# EAGLE design ex_v2 (EAGLE 9.7.0)
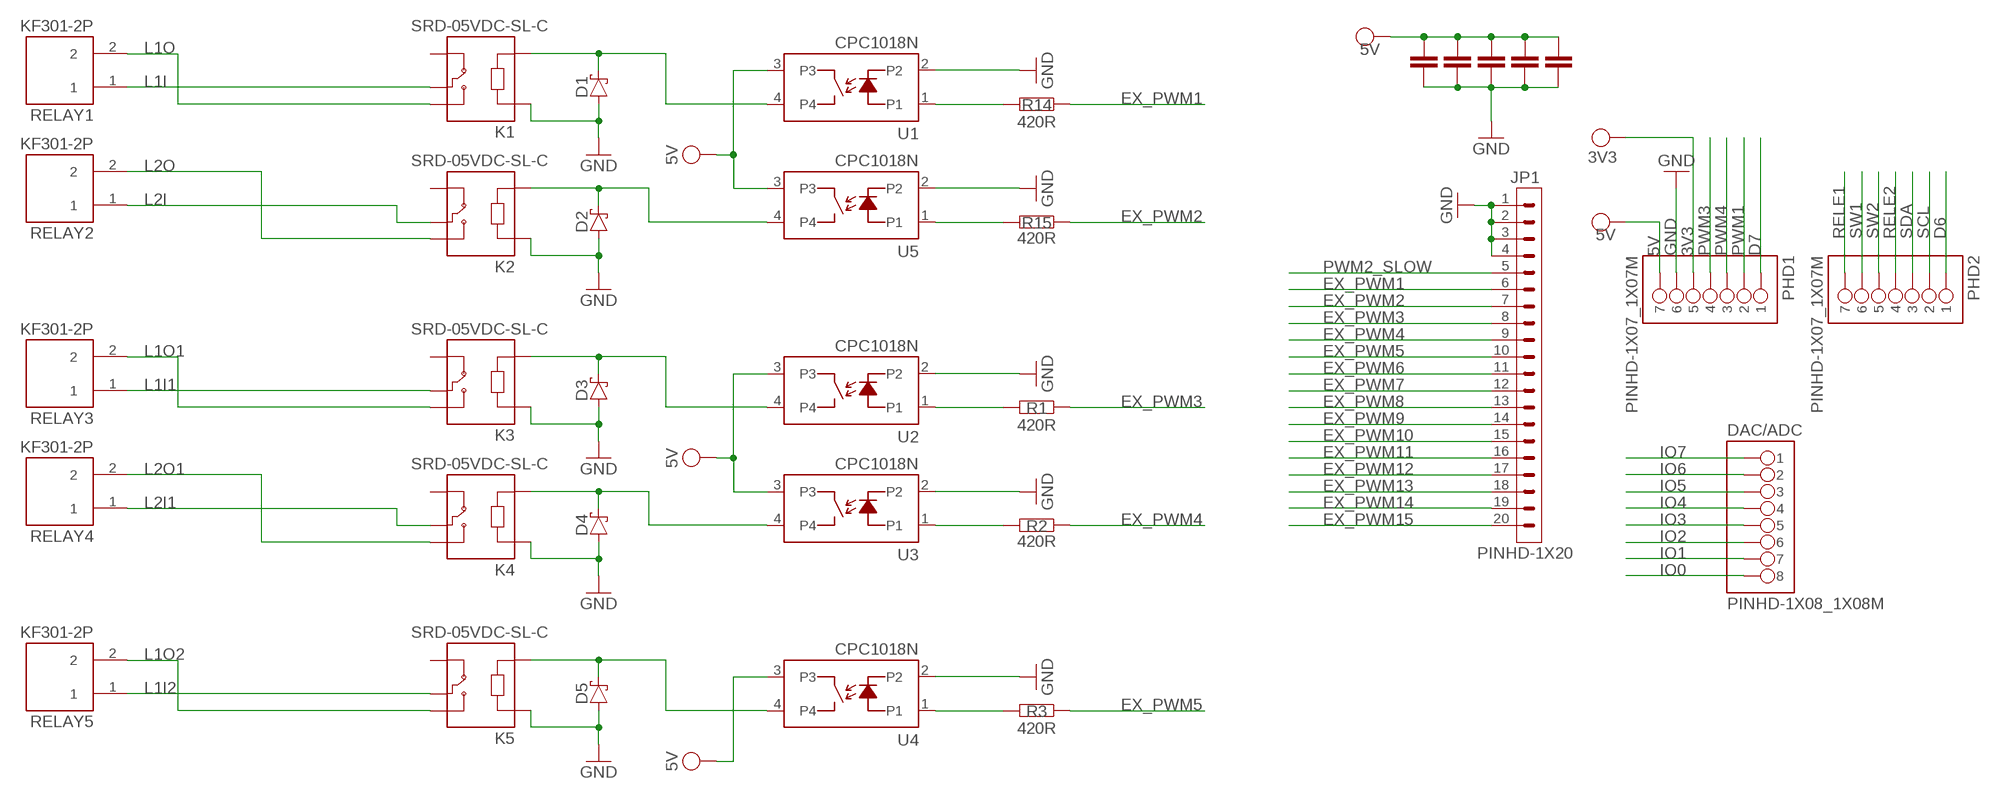
[diagram p0: schematic, sheet 1]

## Parts
C1  10uF  C_CHIP-0805(2012-METRIC)  [CAPC2012X110]
C2  10uF  C_CHIP-0805(2012-METRIC)  [CAPC2012X110]
C3  10uF  C_CHIP-0805(2012-METRIC)  [CAPC2012X110]
C6  10uF  C_CHIP-0805(2012-METRIC)  [CAPC2012X110]
C8  10uF  C_CHIP-0805(2012-METRIC)  [CAPC2012X110]
D1  SCHOTTKY_MBR0520LT1GDO-219  [SODFL3718X115]
D2  SCHOTTKY_MBR0520LT1GDO-219  [SODFL3718X115]
D3  SCHOTTKY_MBR0520LT1GDO-219  [SODFL3718X115]
D4  SCHOTTKY_MBR0520LT1GDO-219  [SODFL3718X115]
D5  SCHOTTKY_MBR0520LT1GDO-219  [SODFL3718X115]
DAC/ADC  PINHD-1X08_1X08M  [1X08]
JP1  PINHD-1X20  [1X20]
K1  SRD-05VDC-SL-C  [RELAY_SRD-05VDC-SL-C]
K2  SRD-05VDC-SL-C  [RELAY_SRD-05VDC-SL-C]
K3  SRD-05VDC-SL-C  [RELAY_SRD-05VDC-SL-C]
K4  SRD-05VDC-SL-C  [RELAY_SRD-05VDC-SL-C]
K5  SRD-05VDC-SL-C  [RELAY_SRD-05VDC-SL-C]
PHD1  PINHD-1X07_1X07M  [1X07]
PHD2  PINHD-1X07_1X07M  [1X07]
R1  420R  R_CHIP-0603(1608-METRIC)  [RESC1608X60]
R2  420R  R_CHIP-0603(1608-METRIC)  [RESC1608X60]
R3  420R  R_CHIP-0603(1608-METRIC)  [RESC1608X60]
R14  420R  R_CHIP-0603(1608-METRIC)  [RESC1608X60]
R15  420R  R_CHIP-0603(1608-METRIC)  [RESC1608X60]
RELAY1  KF301-2P  [HANDSON_KF301-2P]
RELAY2  KF301-2P  [HANDSON_KF301-2P]
RELAY3  KF301-2P  [HANDSON_KF301-2P]
RELAY4  KF301-2P  [HANDSON_KF301-2P]
RELAY5  KF301-2P  [HANDSON_KF301-2P]
U1  CPC1018N  [CLARE_SO4]
U2  CPC1018N  [CLARE_SO4]
U3  CPC1018N  [CLARE_SO4]
U4  CPC1018N  [CLARE_SO4]
U5  CPC1018N  [CLARE_SO4]

## Nets
3V3: PHD1.5
5V: C1.1 C2.1 C3.1 C6.1 C8.1 PHD1.7 U1.3 U2.3 U3.3 U4.3 U5.3
D6: PHD2.1
D7: PHD1.1
EX_PWM1: JP1.6 R14.1
EX_PWM2: JP1.7 R15.1
EX_PWM3: JP1.8 R1.1
EX_PWM4: JP1.9 R2.1
EX_PWM5: JP1.10 R3.1
EX_PWM6: JP1.11
EX_PWM7: JP1.12
EX_PWM8: JP1.13
EX_PWM9: JP1.14
EX_PWM10: JP1.15
EX_PWM11: JP1.16
EX_PWM12: JP1.17
EX_PWM13: JP1.18
EX_PWM14: JP1.19
EX_PWM15: JP1.20
GND: C1.2 C2.2 C3.2 C6.2 C8.2 D1.2(A) D2.2(A) D3.2(A) D4.2(A) D5.2(A) JP1.1 JP1.2 JP1.3 JP1.4 K1.A1 K2.A1 K3.A1 K4.A1 K5.A1 PHD1.6 U1.2 U2.2 U3.2 U4.2 U5.2
IO0: DAC/ADC.8
IO1: DAC/ADC.7
IO2: DAC/ADC.6
IO3: DAC/ADC.5
IO4: DAC/ADC.4
IO5: DAC/ADC.3
IO6: DAC/ADC.2
IO7: DAC/ADC.1
L1I: K1.COM RELAY1.1
L1I1: K3.COM RELAY3.1
L1I2: K5.COM RELAY5.1
L1O: K1.NO RELAY1.2
L1O1: K3.NO RELAY3.2
L1O2: K5.NO RELAY5.2
L2I: K2.COM RELAY2.1
L2I1: K4.COM RELAY4.1
L2O: K2.NO RELAY2.2
L2O1: K4.NO RELAY4.2
N$3: R1.2 U2.1
N$4: R2.2 U3.1
N$5: D4.1(C) K4.A2 U3.4
N$6: D3.1(C) K3.A2 U2.4
N$8: D2.1(C) K2.A2 U5.4
N$9: D1.1(C) K1.A2 U1.4
N$11: R3.2 U4.1
N$14: D5.1(C) K5.A2 U4.4
N$18: R14.2 U1.1
N$19: R15.2 U5.1
PWM1: PHD1.2
PWM2_SLOW: JP1.5
PWM3: PHD1.4
PWM4: PHD1.3
RELE1: PHD2.7
RELE2: PHD2.4
SCL: PHD2.2
SDA: PHD2.3
SW1: PHD2.6
SW2: PHD2.5
Unconnected: K1.NC K2.NC K3.NC K4.NC K5.NC

## Library data of the parts
C1-C3 C6 C8 = Capacitor:C: Capacitor - Generic; CATEGORY: Capacitor; PACKAGE_SIZE: 0805; PACKAGE_TYPE: SMD; SUBCATEGORY: Ceramic Capacitors; TYPE: MLCC
D1-D5 = Diode:SCHOTTKY_: Schottky Diode - Popular Parts; CATEGORY: Diode; DATASHEET: https://www.onsemi.com/download/data-sheet/pdf/mbr0520lt1-d.pdf; DESCRIPTION: Diode 20 V 500mA Surface Mount SOD-123; FORWARD_CURRENT: 500mA; FORWARD_VOLTAGE: 385mV; MANUFACTURER: onsemi; MPN: MBR0520LT1G; OPERATING_TEMPERATURE: -65°C ~ 125°C; PACKAGE_SIZE: SOD-123; PACKAGE_TYPE: Surface Mount; PART_STATUS: Active; REVERSE_VOLTAGE: 20V; ROHS: Compliant; SERIES: MBR0520; SUBCATEGORY: Schottky Diodes; TYPE: Schottky Power Rectifier; ZENER_VOLTAGE: NA
DAC/ADC = Tinkercad:PINHD-1X08
JP1 = Connector:PINHD-1X20: Pin Header; CATEGORY: Connectors; DESCRIPTION: Header-Straight-10 Position; PACKAGE_TYPE: Through Hole; PITCH: 0.100" (2.54mm); SUBCATEGORY: Headers; TYPE: Male Pins
K1-K5 = SRD-05VDC-SL-C:SRD-05VDC-SL-C: Check availability <https://pricing.snapeda.com/parts/SRD-05VDC-SL-C/Songle%20Relay/view-part?ref=eda>; AVAILABILITY: In Stock; CHECK_PRICES: https://www.snapeda.com/parts/SRD-05VDC-SL-C/Songle+Relay/view-part/?ref=eda; DESCRIPTION: 5V Trigger Relay Module For Arduino And Raspberry Pi 5V Trigger Relay Module For Arduino And Raspberry Pi; MF: Songle Relay; MP: SRD-05VDC-SL-C; PACKAGE: NON STANDARD-5 Songle Relay; PRICE: None; SNAPEDA_LINK: https://www.snapeda.com/parts/SRD-05VDC-SL-C/Songle+Relay/view-part/?ref=snap
PHD1 PHD2 = Tinkercad:PINHD-1X07
R1-R3 R14 R15 = Resistor:R: Resistor Fixed - Generic; CATEGORY: Resistors; DESCRIPTION: Chip Resistor 1.60 X 0.82 X 0.60 mm body 0603(1608-METRIC) Package; PACKAGE_SIZE: 0603; PACKAGE_TYPE: SMD
RELAY1-RELAY5 = KF301-2P:KF301-2P: Check availability <https://pricing.snapeda.com/parts/KF301-2P/Handson%20Technology/view-part?ref=eda>; AVAILABILITY: Not in stock; CHECK_PRICES: https://www.snapeda.com/parts/KF301-2P/Handson+Technology/view-part/?ref=eda; DESCRIPTION: 2 Pin Terminal Block 5mm Pitch; MF: Handson Technology; MP: KF301-2P; PACKAGE: None; PRICE: None; SNAPEDA_LINK: https://www.snapeda.com/parts/KF301-2P/Handson+Technology/view-part/?ref=snap
U1-U5 = CPC1018N:CPC1018N: Check availability <https://pricing.snapeda.com/parts/CPC1018N/IXYS%20Integrated%20Circuits/view-part?ref=eda>; AVAILABILITY: In Stock; CHECK_PRICES: https://www.snapeda.com/parts/CPC1018N/IXYS/view-part/?ref=eda; DESCRIPTION: Solid State Photo-Coupled Relay (Photorelay) SPST-NO (1 Form A) 4-SOP (0.150, 3.81mm); MF: IXYS Integrated Circuits; MP: CPC1018N; PACKAGE: SOP-4 Ixys Corporation; PRICE: None; SNAPEDA_LINK: https://www.snapeda.com/parts/CPC1018N/IXYS/view-part/?ref=snap

## Board
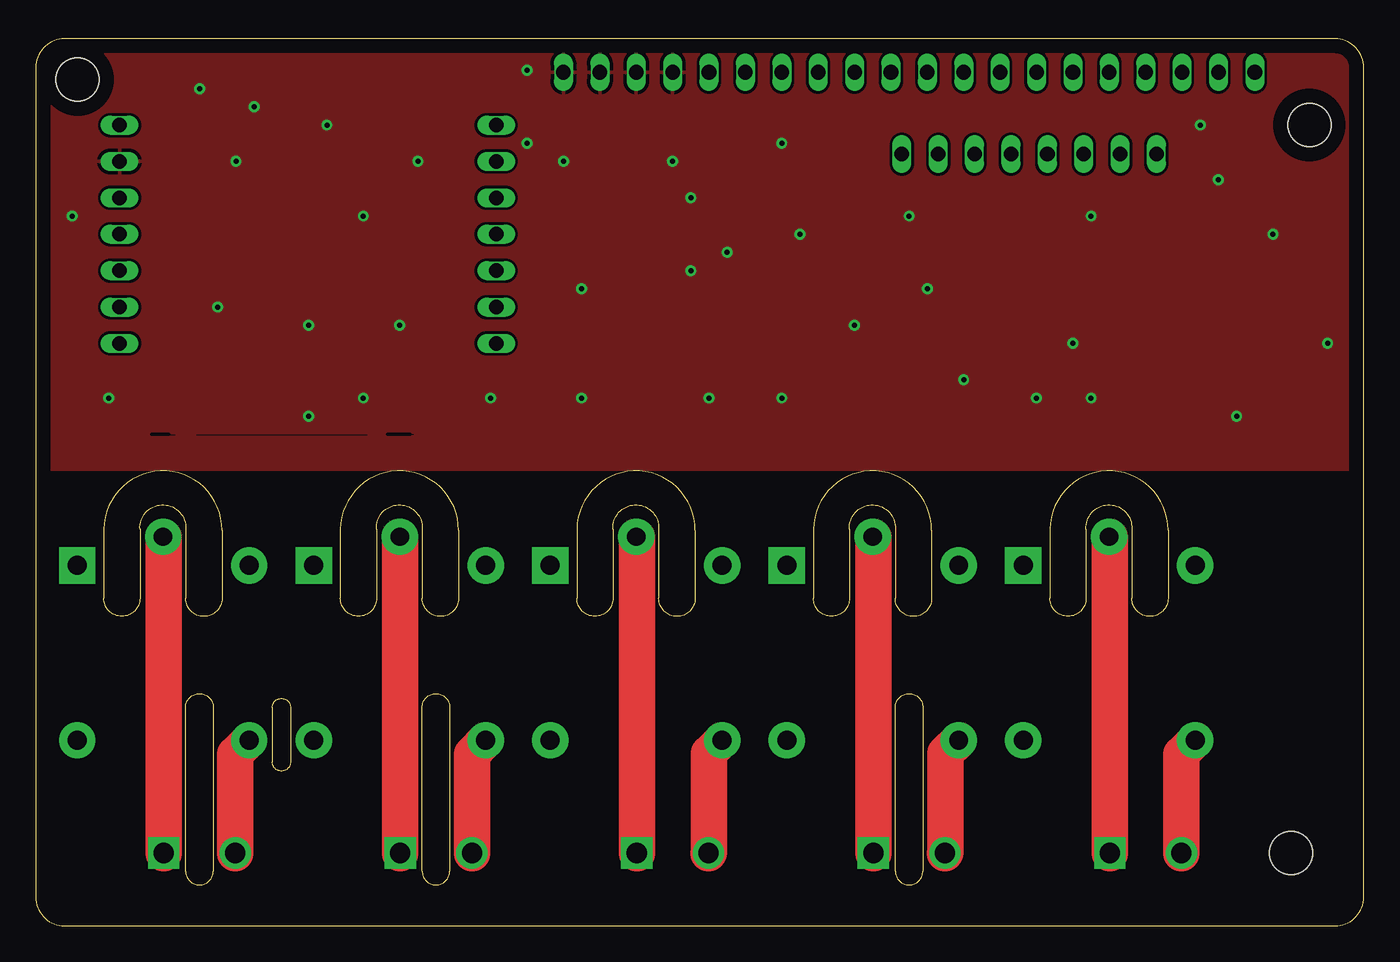
[diagram p1: board, top side]
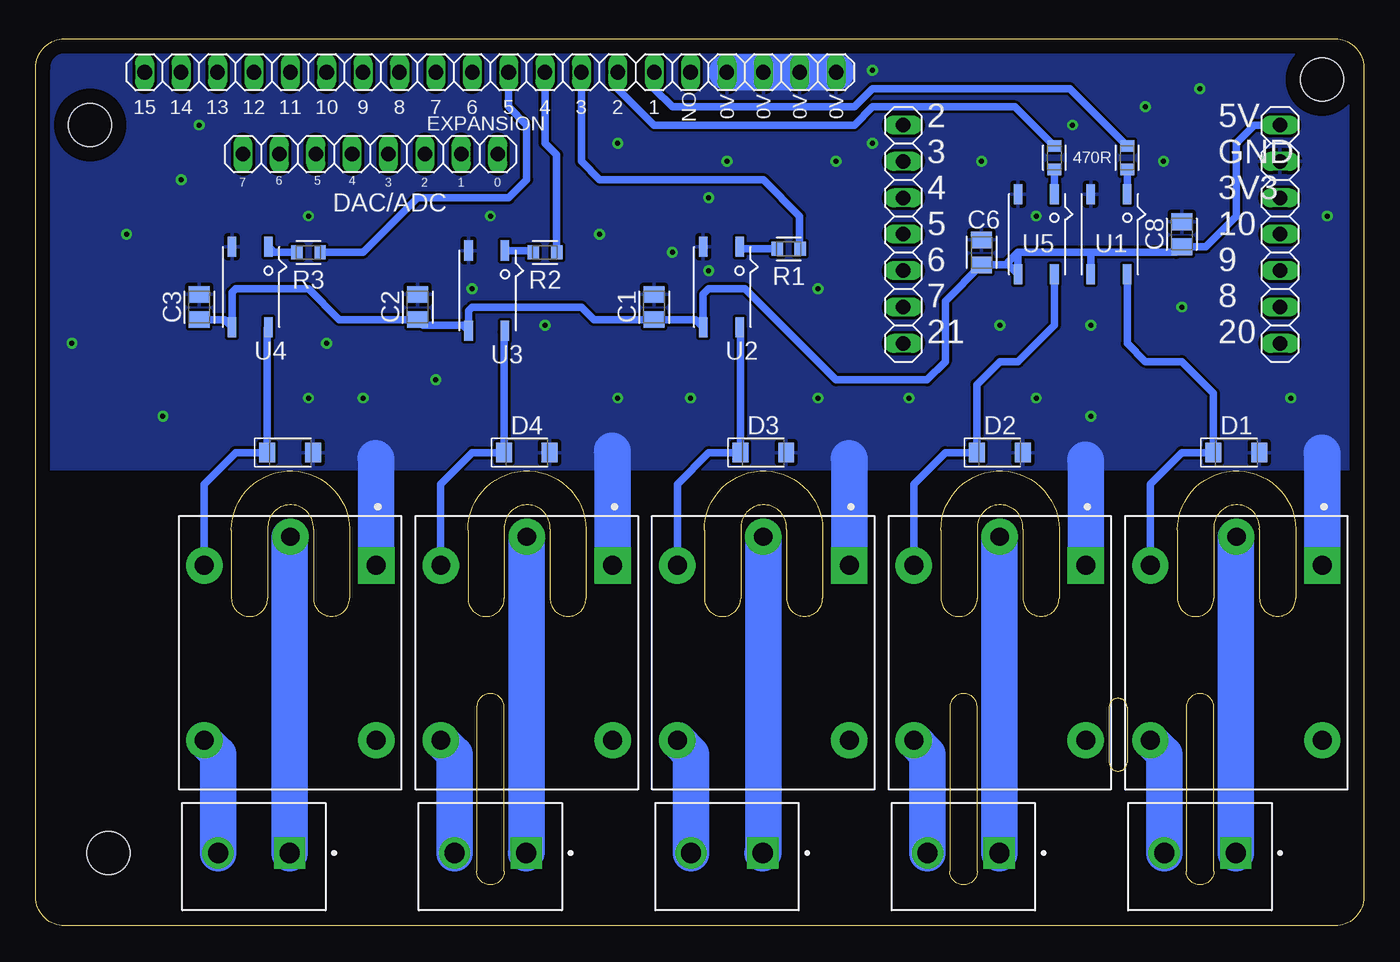
[diagram p2: board, bottom side, seen from below]

Size 92.69 x 61.9 mm. Coordinates in mm from the lower left corner, seen from the top.
Outline: 0,59.9 0,2 arc90 2,0 90.69,0 arc90 92.69,2 92.69,59.9 arc90 90.69,61.9 2,61.9 arc90 0,59.9
Copper layers (1*16): Top 0.035mm / dielectric 1.5mm / Bottom 0.035mm
Design rules "Fusion Electronics Design Rules *": minimum track width 0.2mm, minimum drill 0.35mm, track to track 0.2mm, track to pad 0.2mm, pad to pad 6mil, via to via 6mil, smd to smd 6mil, copper to edge 40mil, drill to drill 6mil, minimum pad ring 0.1mm, minimum via ring 0.204mm, stop-mask expansion 4mil, vias tented up to drill 9999mil, thermal gap 10mil
Holes 3 mm at 88.9,55.88 87.63,5.08 2.92,59.05
tRestrict: 5 lines
Milling: 56 lines

### Footprints (pad centres in the part's own frame; a part is rotated, then mirrored left to right if it is on the bottom)
CAPC2012X110 = smd 1.165 x 1.465: 1 -0.875,0; 2 0.875,0
SODFL3718X115 = smd 1.115 x 1.361: 1 -1.6,0; 2 1.6,0
1X08 = drill 1.016 long: 1 -8.89,0; 2 -6.35,0; 3 -3.81,0; 4 -1.27,0; 5 1.27,0; 6 3.81,0; 7 6.35,0; 8 8.89,0
1X20 = drill 1.016 long: 1 -24.13,0; 2 -21.59,0; 3 -19.05,0; 4 -16.51,0; 5 -13.97,0; 6 -11.43,0; 7 -8.89,0; 8 -6.35,0; 9 -3.81,0; 10 -1.27,0; 11 1.27,0; 12 3.81,0; 13 6.35,0; 14 8.89,0; 15 11.43,0; 16 13.97,0; 17 16.51,0; 18 19.05,0; 19 21.59,0; 20 24.13,0
RELAY_SRD-05VDC-SL-C = drill 1.32 pad 2.54 square: A1 -6.1,6 | drill 1.32 pad 2.54: A2 -6.1,-6; NC 6.1,6; NO 6.1,-6 | drill 1.29 pad 2.54: COM -8.1,0
1X07 = drill 1.016 long: 1 -7.62,0; 2 -5.08,0; 3 -2.54,0; 4 0,0; 5 2.54,0; 6 5.08,0; 7 7.62,0
RESC1608X60 = smd 0.799 x 0.974: 1 -0.815,0; 2 0.815,0
HANDSON_KF301-2P = drill 1.4 pad 2.184 square: 1 -2.5,0 | drill 1.4 pad 2.184: 2 2.5,0
CLARE_SO4 = smd 0.6 x 1.4: 1 -1.27,-2.8; 2 1.27,-2.8; 3 1.27,2.8; 4 -1.27,2.8

### Placement (x,y rotation side)
C1  49.53,43.18 90 bottom
C2  66.04,43.18 90 bottom
C3  81.28,43.18 90 bottom
C6  26.67,46.99 90 bottom
C8  12.7,48.26 90 bottom
D1  8.89,33.02 0 bottom
D2  25.4,33.02 0 bottom
D3  41.91,33.02 0 bottom
D4  58.42,33.02 0 bottom
D5  74.93,33.02 0 bottom
DAC/ADC  69.34,53.85 0 bottom
JP1  60.96,59.56 180 bottom
K1  8.89,19.05 270 bottom
K2  25.4,19.05 270 bottom
K3  41.91,19.05 270 bottom
K4  58.42,19.05 270 bottom
K5  74.93,19.05 270 bottom
PHD1  5.84,48.26 90 bottom
PHD2  32.13,48.26 90 bottom
R1  40.13,47.24 180 bottom
R2  57.15,46.99 180 bottom
R3  73.66,46.99 180 bottom
R14  16.51,53.59 270 bottom
R15  21.59,53.59 270 bottom
RELAY1  11.43,5.08 180 bottom
RELAY2  27.94,5.08 180 bottom
RELAY3  44.45,5.08 180 bottom
RELAY4  60.96,5.08 180 bottom
RELAY5  77.47,5.08 180 bottom
U1  17.78,48.26 180 bottom
U2  44.83,44.58 180 bottom
U3  61.21,44.32 180 bottom
U4  77.72,44.58 180 bottom
U5  22.86,48.26 180 bottom

### Tracks (layer width: path | path; a pad name or v marks a point on that pad's centre or on a via)
5V
  Bottom 0.508: C3.1 79.52,42.3 U4.3 78.99,44.2 78.74,44.45 73.66,44.45 71.52,42.3 C2.1 65.64,41.91 62.87,41.91 U3.3 62.48,42.93 62.23,43.18 54.61,43.18 53.73,42.3 C1.1 46.63,42.3 U2.3 46.1,44.07 45.72,44.45 43.18,44.45 36.83,38.1 30.48,38.1 29.21,39.37 29.21,43.58 C6.1 24.79,46.12 | U1.3 19.05,46.99 | 19.05,46.99 24.13,46.99 | 24.13,46.99 U5.3 24.79,46.12 | 24.79,46.12 24.79,46.34 24.13,46.99 | 19.05,46.99 13.1,46.99 C8.1 11.04,47.38 8.89,49.53 8.89,54.61 7.62,55.88 PHD1.7
EX_PWM1
  Bottom 0.508: R14.1 20.52,58.42 34.29,58.42 35.56,57.15 48.26,57.15 49.53,58.42 JP1.6
EX_PWM2
  Bottom 0.508: R15.1 24.33,57.15 34.29,57.15 35.56,55.88 49.53,55.88 52.07,58.42 JP1.7
EX_PWM3
  Bottom 0.508: R1.1 39.37,47.3 39.37,49.53 41.91,52.07 53.34,52.07 54.61,53.34 JP1.8
EX_PWM4
  Bottom 0.508: R2.1 56.34,53.8 57.15,54.61 JP1.9
EX_PWM5
  Bottom 0.508: R3.1 69.85,46.99 66.04,50.8 59.69,50.8 58.42,52.07 58.42,55.88 59.69,57.15 JP1.10
GND  (via drill 0.35)
  Bottom 2.54: K1.A1 2.89,32.99 2.92,33.02 | K2.A1 19.4,32.48 19.43,32.51 | K3.A1 35.91,32.61 35.94,32.64 | K4.A1 52.42,33.12 52.45,33.15 | K5.A1 68.93,32.61 68.96,32.64 | JP1.4 JP1.3 JP1.2 JP1.1
  other vias: 69.85,36.83 64.77,38.1 52.07,36.83 38.1,36.83 22.86,36.83 5.08,36.83 2.54,49.53 11.43,58.42 13.97,53.34 20.32,55.88 26.67,53.34 22.86,49.53 36.83,53.34 52.07,54.61 45.72,50.8 38.1,44.45 53.34,48.26 60.96,49.53 57.15,41.91 62.23,44.45 73.66,49.53 82.55,52.07 81.28,55.88 34.29,59.69 34.29,54.61 46.99,36.83 72.39,40.64 73.66,36.83 83.82,35.56 90.17,40.64 86.36,48.26 31.75,36.83 19.05,41.91 19.05,35.56 12.7,43.18 15.24,57.15 44.45,53.34 48.26,46.99 45.72,45.72 25.4,41.91
  pour Bottom: -1.19,31.83 92.63,31.83 92.63,63.42 -1.19,63.42
  pour Top: -1.24,31.83 92.63,31.83 92.63,64.69 -1.24,64.69 -2.46,63.47 -2.46,33.05
L1I
  Top 2.54: RELAY1.1 8.93,27.11 K1.COM
  Bottom 2.54: RELAY1.1 8.93,27.11 K1.COM
L1I1
  Top 2.54: RELAY3.1 41.95,27.11 K3.COM
  Bottom 2.54: RELAY3.1 41.91,5.12 K3.COM
L1I2
  Top 2.54: RELAY5.1 74.97,27.11 K5.COM
  Bottom 2.54: RELAY5.1 74.97,27.11 K5.COM
L1O
  Top 2.54: RELAY1.2 13.93,11.99 K1.NO
  Bottom 2.54: RELAY1.2 13.93,11.99 K1.NO
L1O1
  Top 2.54: RELAY3.2 46.99,5.12 46.99,12.03 K3.NO
  Bottom 2.54: RELAY3.2 46.95,11.99 K3.NO
L1O2
  Top 2.54: RELAY5.2 79.97,11.99 K5.NO
  Bottom 2.54: RELAY5.2 79.97,11.99 K5.NO
L2I
  Top 2.54: RELAY2.1 25.44,27.11 K2.COM
  Bottom 2.54: RELAY2.1 25.44,27.11 K2.COM
L2I1
  Top 2.54: RELAY4.1 58.46,27.11 K4.COM
  Bottom 2.54: RELAY4.1 58.42,5.12 K4.COM
L2O
  Top 2.54: RELAY2.2 30.44,11.99 K2.NO
  Bottom 2.54: RELAY2.2 30.44,11.99 K2.NO
L2O1
  Top 2.54: RELAY4.2 63.5,5.12 63.5,12.03 K4.NO
  Bottom 2.54: RELAY4.2 63.46,11.99 K4.NO
N$3
  Bottom 0.508: R1.2 43.43,47.24 U2.1
N$4
  Bottom 0.508: R2.2 58.1,47.12 U3.1
N$5
  Bottom 0.508: K4.A2 64.42,30.83 62.23,33.02 D4.1 60.02,41.45 U3.4
N$6
  Bottom 0.508: K3.A2 47.91,30.83 45.72,33.02 D3.1 43.51,41.73 U2.4
N$8
  Bottom 0.508: K2.A2 31.4,30.83 29.21,33.02 D2.1 27,37.77 25.4,39.37 24.13,39.37 21.59,41.91 U5.4
N$9
  Bottom 0.508: K1.A2 14.89,30.83 12.7,33.02 D1.1 10.49,37.16 12.7,39.37 15.24,39.37 16.51,40.64 U1.4
N$11
  Bottom 0.508: U4.1 76.07,46.99 R3.2
N$14
  Bottom 0.508: K5.A2 80.93,30.83 78.74,33.02 D5.1 76.53,41.7 U4.4
N$18
  Bottom 0.508: R14.2 U1.1
N$19
  Bottom 0.508: R15.2 U5.1

### Text on the board
bNames: 0V | 0V | 0V | 0V | NO | 1 | 2 | 3 | 4 | 5 | 6 | 7 | 8 | 9 | 10 | 11 | 12 | 13 | 14 | 15 | EXPANSION | 470R | 0 | 1 | 2 | 3 | 4 | 5 | 6 | 7 | 5V / GND / 3V3 / 10 / 9 / 8 / 20 | 2 / 3 / 4 / 5 / 6 / 7 / 21